# EAGLE board MusselGapeTracker_RevA_2 (EAGLE 7.6.0), part 1 of 2
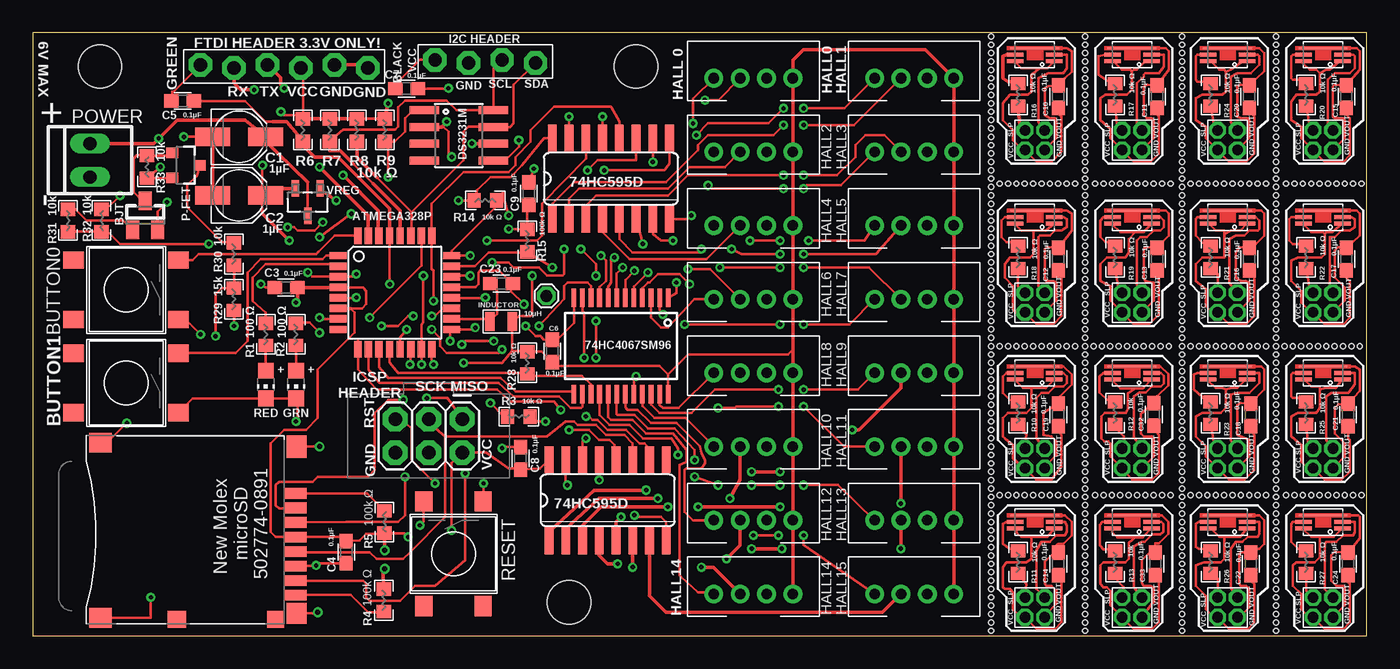
[diagram p1: board, top side]
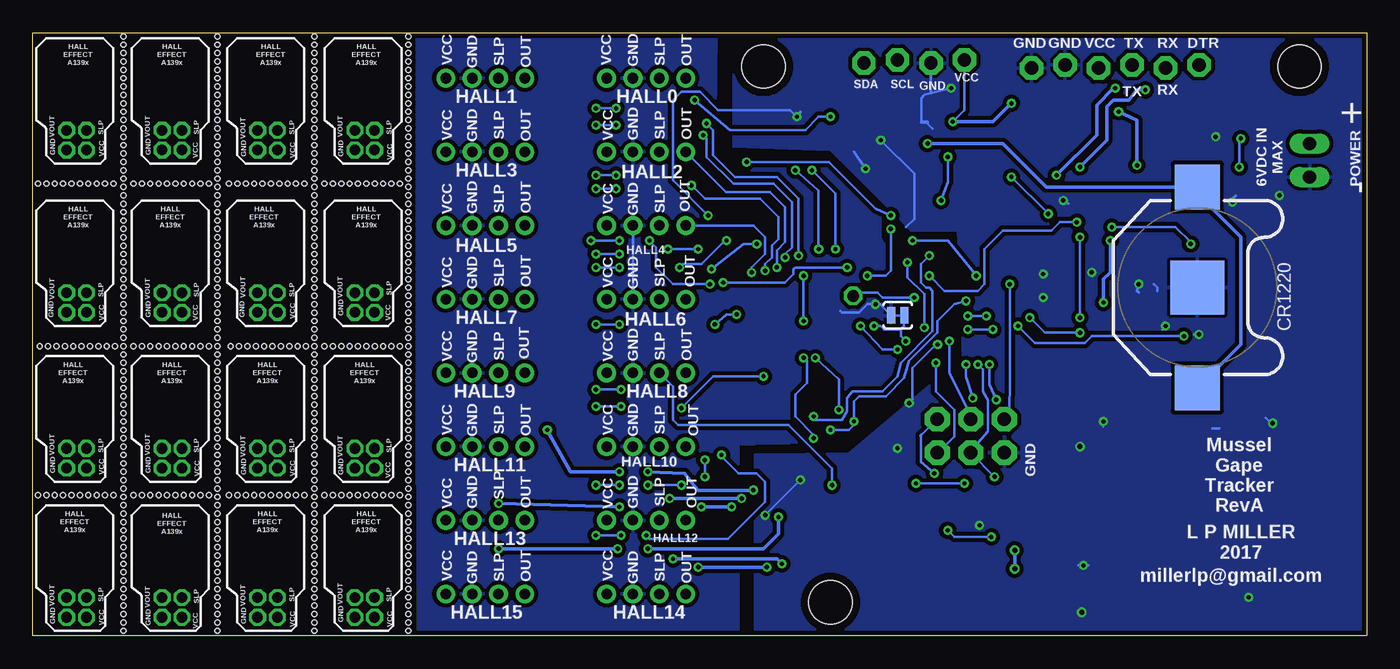
[diagram p2: board, bottom side, seen from below]

Size 101.09 x 45.72 mm. Coordinates in mm from the lower left corner, seen from the top.
Outline: 0,0 101.09,0 101.09,45.72 0,45.72 0,0
Copper layers (1*16): Top 0.0356mm / dielectric 1.5011mm / Bottom 0.0356mm
Design rules "LaenPCBOrder *": minimum track width 6mil, minimum drill 13mil, track to track 6mil, track to pad 6mil, pad to pad 6mil, via to via 6mil, smd to smd 6mil, copper to edge 15mil, drill to drill 6mil, minimum pad ring 7mil, minimum via ring 7mil, stop-mask expansion 3mil, vias tented up to drill 30mil, thermal gap 10mil
Holes 0.38 mm at 72.64,0.38 72.64,1.02 72.64,1.65 72.64,2.29 72.64,2.92 72.64,3.56 72.64,4.19 72.64,4.83 72.64,5.46 72.64,6.1 72.64,6.73 72.64,7.37 72.64,8 72.64,8.64 72.64,9.27 72.64,9.91 72.64,10.54 72.64,11.18 72.64,11.81 72.64,12.45 72.64,13.08 72.64,13.72 72.64,14.35 72.64,14.99 72.64,15.62 72.64,16.26 72.64,16.89 72.64,17.53 72.64,18.16 72.64,18.8 72.64,19.43 72.64,20.07 72.64,20.7 72.64,21.34 72.64,21.97 72.64,22.61 72.64,23.24 72.64,23.88 72.64,24.51 72.64,25.15 72.64,25.78 72.64,26.42 72.64,27.05 72.64,27.69 72.64,28.32 72.64,28.96 72.64,29.59 72.64,30.23 72.64,30.86 72.64,31.5 72.64,32.13 72.64,32.77 72.64,33.4 72.64,34.04 72.64,34.67 72.64,35.31 72.64,35.94 72.64,36.58 72.64,37.21 72.64,37.85 72.64,38.48 72.64,39.12 72.64,39.75 72.64,40.39 72.64,41.02 72.64,41.66 72.64,42.29 72.64,42.93 72.64,43.56 72.64,44.2 72.64,44.83 72.64,45.47 78.99,34.29 78.36,34.29 77.72,34.29 77.09,34.29 76.45,34.29 75.82,34.29 75.18,34.29 74.55,34.29 73.91,34.29 73.28,34.29 73.28,10.67 73.91,10.67 74.55,10.67 75.18,10.67 75.82,10.67 76.45,10.67 77.09,10.67 77.72,10.67 73.28,21.97 73.91,21.97 74.55,21.97 75.18,21.97 75.82,21.97 76.45,21.97 77.09,21.97 77.72,21.97 78.36,21.97 78.99,21.97 78.36,10.67 78.99,10.67 79.76,0.38 79.76,1.02 79.76,1.65 79.76,2.29 79.76,2.92 79.76,3.56 79.76,4.19 79.76,4.83 79.76,5.46 79.76,6.1 79.76,6.73 79.76,7.37 79.76,8 79.76,8.64 79.76,9.27 79.76,9.91 79.76,10.54 79.76,11.18 79.76,11.81 79.76,12.45 79.76,13.08 79.76,13.72 79.76,14.35 79.76,14.99 79.76,15.62 79.76,16.26 79.76,16.89 79.76,17.53 79.76,18.16 79.76,18.8 79.76,19.43 79.76,20.07 79.76,20.7 79.76,21.34 79.76,21.97 79.76,22.61 79.76,23.24 79.76,23.88 79.76,24.51 79.76,25.15 79.76,25.78 79.76,26.42 79.76,27.05 79.76,27.69 79.76,28.32 79.76,28.96 79.76,29.59 79.76,30.23 79.76,30.86 79.76,31.5 79.76,32.13 79.76,32.77 79.76,33.4 79.76,34.04 79.76,34.67 79.76,35.31 79.76,35.94 79.76,36.58 79.76,37.21 79.76,37.85 79.76,38.48 79.76,39.12 79.76,39.75 79.76,40.39 79.76,41.02 79.76,41.66 79.76,42.29 79.76,42.93 79.76,43.56 79.76,44.2 79.76,44.83 79.76,45.47 80.52,10.67 81.15,10.67 81.79,10.67 82.42,10.67 83.06,10.67 83.69,10.67 84.33,10.67 84.96,10.67 85.6,10.67 86.23,10.67 80.39,21.97 81.03,21.97 81.66,21.97 82.3,21.97 82.93,21.97 83.57,21.97 84.2,21.97 84.84,21.97 85.47,21.97 86.11,21.97 86.23,34.29 85.6,34.29 84.96,34.29 84.33,34.29 83.69,34.29 83.06,34.29 82.42,34.29 81.79,34.29 81.15,34.29 80.52,34.29 87.12,0.38 87.12,1.02 87.12,1.65 87.12,2.29 87.12,2.92 87.12,3.56 87.12,4.19 87.12,4.83 87.12,5.46 87.12,6.1 87.12,6.73 87.12,7.37 87.12,8 87.12,8.64 87.12,9.27 87.12,9.91 87.12,10.54 87.12,11.18 87.12,11.81 87.12,12.45 87.12,13.08 87.12,13.72 87.12,14.35 87.12,14.99 87.12,15.62 87.12,16.26 87.12,16.89 87.12,17.53 87.12,18.16 87.12,18.8 87.12,19.43 87.12,20.07 87.12,20.7 87.12,21.34 87.12,21.97 87.12,22.61 87.12,23.24 87.12,23.88 87.12,24.51 87.12,25.15 87.12,25.78 87.12,26.42 87.12,27.05 87.12,27.69 87.12,28.32 87.12,28.96 87.12,29.59 87.12,30.23 87.12,30.86 87.12,31.5 87.12,32.13 87.12,32.77 87.12,33.4 87.12,34.04 87.12,34.67 87.12,35.31 87.12,35.94 87.12,36.58 87.12,37.21 87.12,37.85 87.12,38.48 87.12,39.12 87.12,39.75 87.12,40.39 87.12,41.02 87.12,41.66 87.12,42.29 87.12,42.93 87.12,43.56 87.12,44.2 87.12,44.83 87.12,45.47 93.47,34.29 92.84,34.29 92.2,34.29 91.57,34.29 90.93,34.29 90.3,34.29 89.66,34.29 89.03,34.29 88.39,34.29 87.76,34.29 87.76,10.67 88.39,10.67 89.03,10.67 89.66,10.67 90.3,10.67 90.93,10.67 91.57,10.67 92.2,10.67 87.76,21.97 88.39,21.97 89.03,21.97 89.66,21.97 90.3,21.97 90.93,21.97 91.57,21.97 92.2,21.97 92.84,21.97 93.47,21.97 92.84,10.67 93.47,10.67 94.23,0.38 94.23,1.02 94.23,1.65 94.23,2.29 94.23,2.92 94.23,3.56 94.23,4.19 94.23,4.83 94.23,5.46 94.23,6.1 94.23,6.73 94.23,7.37 94.23,8 94.23,8.64 94.23,9.27 94.23,9.91 94.23,10.54 94.23,11.18 94.23,11.81 94.23,12.45 94.23,13.08 94.23,13.72 94.23,14.35 94.23,14.99 94.23,15.62 94.23,16.26 94.23,16.89 94.23,17.53 94.23,18.16 94.23,18.8 94.23,19.43 94.23,20.07 94.23,20.7 94.23,21.34 94.23,21.97 94.23,22.61 94.23,23.24 94.23,23.88 94.23,24.51 94.23,25.15 94.23,25.78 94.23,26.42 94.23,27.05 94.23,27.69 94.23,28.32 94.23,28.96 94.23,29.59 94.23,30.23 94.23,30.86 94.23,31.5 94.23,32.13 94.23,32.77 94.23,33.4 94.23,34.04 94.23,34.67 94.23,35.31 94.23,35.94 94.23,36.58 94.23,37.21 94.23,37.85 94.23,38.48 94.23,39.12 94.23,39.75 94.23,40.39 94.23,41.02 94.23,41.66 94.23,42.29 94.23,42.93 94.23,43.56 94.23,44.2 94.23,44.83 94.23,45.47 95,10.67 95.63,10.67 96.27,10.67 96.9,10.67 97.54,10.67 98.17,10.67 98.81,10.67 99.44,10.67 100.08,10.67 100.71,10.67 94.87,21.97 95.5,21.97 96.14,21.97 96.77,21.97 97.41,21.97 98.04,21.97 98.68,21.97 99.31,21.97 99.95,21.97 100.58,21.97 100.71,34.29 100.08,34.29 99.44,34.29 98.81,34.29 98.17,34.29 97.54,34.29 96.9,34.29 96.27,34.29 95.63,34.29 95,34.29
tRestrict: area 51.6,40.4 to 53.3,42.2; area 51.6,28.4 to 53.3,30.2

## Footprints (pad centres in the part's own frame; a part is rotated, then mirrored left to right if it is on the bottom)
A139*_HALL_EFFECT = smd 0.3 x 1.25: P$1 -0.5,-1.475; P$2 0,-1.475; P$5 0,1.475; P$6 -0.5,1.475 | smd 0.15 x 3.7: P$3_4 0.5,0
SOT23 = smd 1 x 1.4: 1 -0.95,-1.1; 2 0.95,-1.1; 3 0,1.1
PUSHBUTTON_DPST_SMD = smd 1.55 x 1.3: P 3.975,-2.25; P$1 -3.975,-2.25; S 3.975,2.25; S$1 -3.975,2.25
PANASONIC_B = smd 2.667 x 1.4: + 2.006,0; - -2.006,0
0603 = smd 1.1 x 1: 1 -0.85,0; 2 0.85,0
CR1220_BATTERY_HOLDER_SMD = smd 4.064 x 4.064: GND 0,0 | smd 3.429 x 3.429: P$1 -7.62,0; P$2 7.62,0
DS3231M_SOIC8 = smd 0.61 x 2.21: 1 -1.905,-2.616; 2 -0.635,-2.616; 3 0.635,-2.616; 4 1.905,-2.616; 5 1.905,2.616; 6 0.635,2.616; 7 -0.635,2.616; 8 -1.905,2.616
SJ_2S-TRACE = smd 0.635 x 1.27: 1 -0.508,0; 2 0.508,0
JST-PH-4-THM = drill 0.8 pad 1.422: 1 3,0; 2 1,0; 3 -1,0; 4 -3,0
2X2_1.5MM = drill 0.8 pad 1.27 octagon: P$1 -0.75,0.75; P$2 0.75,0.75; P$3 -0.75,-0.75; P$4 0.75,-0.75
1X04_BIGLOCK = drill 1.016 pad 1.778 octagon: 1 -3.81,0.127; 2 -1.27,-0.127; 3 1.27,0.127; 4 3.81,-0.127
I_0805 = smd 0.7 x 1.45: P$1 -0.85,0; P$2 0.85,0
2X3 = drill 1.016 pad 1.88 octagon: 1 -2.54,0; 2 -2.54,2.54; 3 0,0; 4 0,2.54; 5 2.54,0; 6 2.54,2.54
1X06-BIGLOCK = drill 1.016 pad 1.778 octagon: 1 -6.35,0.127; 2 -3.81,-0.127; 3 -1.27,0.127; 4 1.27,-0.127; 5 3.81,0.127; 6 6.35,-0.127
CHIPLED_0805 = smd 1.2 x 1.2: A 0,-1.05; C 0,1.05
SOT95P237X112-3N = smd 0.559 x 1.27: 1 -0.94,-1.041; 2 0.94,-1.041; 3 0,1.041
SOT23-3 = smd 0.8 x 0.9: 1 -0.95,-1; 2 0.95,-1; 3 0,1.1
R0603 = smd 1 x 1.1: 1 -0.85,0; 2 0.85,0
SO16 = smd 0.66 x 2.032: 1 -4.445,-3.073; 2 -3.175,-3.073; 3 -1.905,-3.073; 4 -0.635,-3.073; 5 0.635,-3.073; 6 1.905,-3.073; 7 3.175,-3.073; 8 4.445,-3.073; 9 4.445,3.073; 10 3.175,3.073; 11 1.905,3.073; 12 0.635,3.073; 13 -0.635,3.073; 14 -1.905,3.073; 15 -3.175,3.073; 16 -4.445,3.073
STAND-OFF = hole 3.302: 0,0
TQFP32-08 = smd 1.27 x 0.559: 1 -4.293,2.8; 2 -4.293,2; 3 -4.293,1.2; 4 -4.293,0.4; 5 -4.293,-0.4; 6 -4.293,-1.2; 7 -4.293,-2; 8 -4.293,-2.8; 17 4.293,-2.8; 18 4.293,-2; 19 4.293,-1.2; 20 4.293,-0.4; 21 4.293,0.4; 22 4.293,1.2; 23 4.293,2; 24 4.293,2.8 | smd 0.559 x 1.27: 9 -2.8,-4.293; 10 -2,-4.293; 11 -1.2,-4.293; 12 -0.4,-4.293; 13 0.4,-4.293; 14 1.2,-4.293; 15 2,-4.293; 16 2.8,-4.293; 25 2.8,4.293; 26 2,4.293; 27 1.2,4.293; 28 0.4,4.293; 29 -0.4,4.293; 30 -1.2,4.293; 31 -2,4.293; 32 -2.8,4.293
MICROSD_SOCKET_MOLEX_REVERSEMOUNT = smd 1.29 x 1.4: CARD_DETECT1 -0.645,8.12 | smd 1.29 x 1.3: CARD_DETECT2 -0.645,0.65 | smd 0.8 x 1.68: CS2 7.8,-0.84; GND6 3.4,-0.84; MISO7 2.3,-0.84; MOSI3 6.7,-0.84; NC1 8.9,-0.84; RES8 1.2,-0.84; SCK5 4.5,-0.84; VDD4 5.6,-0.84 | smd 1.6 x 1.5: MNT1 -0.2,-0.93 | smd 1.7 x 1.5: MNT2 12.45,-0.93 | smd 1.5 x 1.7: MNT3 -0.54,13.92; MNT4 12.75,13.92
SSOP24 = smd 0.348 x 1.397: 1 -3.575,-3.656; 2 -2.925,-3.656; 3 -2.275,-3.656; 4 -1.625,-3.656; 5 -0.975,-3.656; 6 -0.325,-3.656; 7 0.325,-3.656; 8 0.975,-3.656; 9 1.625,-3.656; 10 2.275,-3.656; 11 2.925,-3.656; 12 3.575,-3.656; 13 3.575,3.656; 14 2.925,3.656; 15 2.275,3.656; 16 1.625,3.656; 17 0.975,3.656; 18 0.325,3.656; 19 -0.325,3.656; 20 -0.975,3.656; 21 -1.625,3.656; 22 -2.275,3.656; 23 -2.925,3.656; 24 -3.575,3.656
1X01_SMALL = drill 0.9 pad 1.397 octagon: 1 0,0
22-23-2021 = drill 1 long: 1 -1.27,0; 2 1.27,0

## Placement (x,y rotation side)
A139_HALL0  HALL_EFFECT_ALLEGRO_A139MLP/DFN-6  [A139*_HALL_EFFECT]  75.95,44.07 90 top
A139_HALL1  HALL_EFFECT_ALLEGRO_A139MLP/DFN-6  [A139*_HALL_EFFECT]  75.95,8.64 90 top
A139_HALL2  HALL_EFFECT_ALLEGRO_A139MLP/DFN-6  [A139*_HALL_EFFECT]  75.95,19.94 90 top
A139_HALL3  HALL_EFFECT_ALLEGRO_A139MLP/DFN-6  [A139*_HALL_EFFECT]  83.31,19.94 90 top
A139_HALL4  HALL_EFFECT_ALLEGRO_A139MLP/DFN-6  [A139*_HALL_EFFECT]  83.31,8.64 90 top
A139_HALL5  HALL_EFFECT_ALLEGRO_A139MLP/DFN-6  [A139*_HALL_EFFECT]  83.31,44.07 90 top
A139_HALL6  HALL_EFFECT_ALLEGRO_A139MLP/DFN-6  [A139*_HALL_EFFECT]  75.95,31.75 90 top
A139_HALL7  HALL_EFFECT_ALLEGRO_A139MLP/DFN-6  [A139*_HALL_EFFECT]  83.31,31.75 90 top
A139_HALL8  HALL_EFFECT_ALLEGRO_A139MLP/DFN-6  [A139*_HALL_EFFECT]  90.55,44.07 90 top
A139_HALL9  HALL_EFFECT_ALLEGRO_A139MLP/DFN-6  [A139*_HALL_EFFECT]  97.79,44.07 90 top
A139_HALL10  HALL_EFFECT_ALLEGRO_A139MLP/DFN-6  [A139*_HALL_EFFECT]  90.55,31.75 90 top
A139_HALL11  HALL_EFFECT_ALLEGRO_A139MLP/DFN-6  [A139*_HALL_EFFECT]  97.79,31.75 90 top
A139_HALL12  HALL_EFFECT_ALLEGRO_A139MLP/DFN-6  [A139*_HALL_EFFECT]  90.55,19.94 90 top
A139_HALL13  HALL_EFFECT_ALLEGRO_A139MLP/DFN-6  [A139*_HALL_EFFECT]  97.79,19.94 90 top
A139_HALL14  HALL_EFFECT_ALLEGRO_A139MLP/DFN-6  [A139*_HALL_EFFECT]  90.55,8.64 90 top
A139_HALL15  HALL_EFFECT_ALLEGRO_A139MLP/DFN-6  [A139*_HALL_EFFECT]  97.79,8.64 90 top
BJT  KSC1623_BJT_TRANSISTOR  [SOT23]  8.51,31.88 0 top
BUTTON0  PUSHBUTTON_DPST_SMDSTANDARD  [PUSHBUTTON_DPST_SMD]  7.06,26.24 180 top
BUTTON1  PUSHBUTTON_DPST_SMDSTANDARD  [PUSHBUTTON_DPST_SMD]  7.06,19.18 180 top
C1  1µF  [PANASONIC_B]  15.62,37.85 0 top
C2  1µF  [PANASONIC_B]  15.62,33.4 0 top
C3  0.1µF  [0603]  19.18,26.42 180 top
C4  0.1µF  [0603]  23.75,6.35 270 top
C5  0.1µF  [0603]  11.35,40.56 0 top
C6  0.1µF  [0603]  39.37,21.59 90 top
C7  0.1µF  [0603]  28.32,41.5 0 top
C8  0.1µF  [0603]  36.96,13.46 90 top
C9  0.1µF  [0603]  37.59,33.53 90 top
C10  0.1µF  [0603]  77.72,40.89 90 top
C11  0.1µF  [0603]  85.22,40.89 90 top
C12  0.1µF  [0603]  77.72,28.57 90 top
C13  0.1µF  [0603]  85.22,28.57 90 top
C14  0.1µF  [0603]  77.72,5.46 90 top
C15  0.1µF  [0603]  99.57,40.89 90 top
C16  0.1µF  [0603]  92.2,28.57 90 top
C17  0.1µF  [0603]  99.57,28.57 90 top
C18  0.1µF  [0603]  92.33,16.76 90 top
C19  0.1µF  [0603]  77.72,16.76 90 top
C20  0.1µF  [0603]  92.2,40.89 90 top
C21  0.1µF  [0603]  99.69,16.76 90 top
C22  0.1µF  [0603]  92.33,5.46 90 top
C23  0.1µF  [0603]  35.51,26.72 0 top
C24  0.1µF  [0603]  99.69,5.46 90 top
C32  0.1µF  [0603]  84.96,16.79 90 top
C33  0.1µF  [0603]  85.09,5.46 90 top
CR1220_BATTERY  CR1220_BATTERY_HOLDERSMD  [CR1220_BATTERY_HOLDER_SMD]  12.83,26.42 270 bottom
DS3231M  DS3231MSOIC-8  [DS3231M_SOIC8]  32.28,37.95 270 top
GROUND_CON  SOLDER_JUMPER_TRACESTANDARD  [SJ_2S-TRACE]  35.53,24.31 180 bottom
HALL0  JST-4PINTH_STRAIGHT  [JST-PH-4-THM]  54.61,42.29 0 top
HALL0_HEADER  PINHD-2X21.5MM_SILK  [2X2_1.5MM]  75.95,37.59 180 top
HALL1  JST-4PINTH_STRAIGHT  [JST-PH-4-THM]  66.8,42.29 0 top
HALL1_HEADER  PINHD-2X21.5MM_SILK  [2X2_1.5MM]  75.95,2.16 180 top
HALL2  JST-4PINTH_STRAIGHT  [JST-PH-4-THM]  54.61,36.7 0 top
HALL2_HEADER  PINHD-2X21.5MM_SILK  [2X2_1.5MM]  75.95,13.46 180 top
HALL3  JST-4PINTH_STRAIGHT  [JST-PH-4-THM]  66.8,36.7 0 top
HALL3_HEADER  PINHD-2X21.5MM_SILK  [2X2_1.5MM]  83.31,13.46 180 top
HALL4  JST-4PINTH_STRAIGHT  [JST-PH-4-THM]  54.61,31.11 0 top
HALL4_HEADER  PINHD-2X21.5MM_SILK  [2X2_1.5MM]  83.31,2.16 180 top
HALL5  JST-4PINTH_STRAIGHT  [JST-PH-4-THM]  66.8,31.11 0 top
HALL5_HEADER  PINHD-2X21.5MM_SILK  [2X2_1.5MM]  83.31,37.59 180 top
HALL6  JST-4PINTH_STRAIGHT  [JST-PH-4-THM]  54.61,25.53 0 top
HALL6_HEADER  PINHD-2X21.5MM_SILK  [2X2_1.5MM]  75.95,25.27 180 top
HALL7  JST-4PINTH_STRAIGHT  [JST-PH-4-THM]  66.8,25.53 0 top
HALL7_HEADER  PINHD-2X21.5MM_SILK  [2X2_1.5MM]  83.31,25.27 180 top
HALL8  JST-4PINTH_STRAIGHT  [JST-PH-4-THM]  54.61,19.94 0 top
HALL8_HEADER  PINHD-2X21.5MM_SILK  [2X2_1.5MM]  90.55,37.59 180 top
HALL9  JST-4PINTH_STRAIGHT  [JST-PH-4-THM]  66.8,19.94 0 top
HALL9_HEADER  PINHD-2X21.5MM_SILK  [2X2_1.5MM]  97.79,37.59 180 top
HALL10  JST-4PINTH_STRAIGHT  [JST-PH-4-THM]  54.61,14.35 0 top
HALL10_HEADER  PINHD-2X21.5MM_SILK  [2X2_1.5MM]  90.55,25.27 180 top
HALL11  JST-4PINTH_STRAIGHT  [JST-PH-4-THM]  66.8,14.35 0 top
HALL11_HEADER  PINHD-2X21.5MM_SILK  [2X2_1.5MM]  97.79,25.27 180 top
HALL12  JST-4PINTH_STRAIGHT  [JST-PH-4-THM]  54.61,8.76 0 top
HALL12_HEADER  PINHD-2X21.5MM_SILK  [2X2_1.5MM]  90.55,13.46 180 top
HALL13  JST-4PINTH_STRAIGHT  [JST-PH-4-THM]  66.8,8.76 0 top
HALL13_HEADER  PINHD-2X21.5MM_SILK  [2X2_1.5MM]  97.79,13.46 180 top
HALL14  JST-4PINTH_STRAIGHT  [JST-PH-4-THM]  54.61,3.17 0 top
HALL14_HEADER  PINHD-2X21.5MM_SILK  [2X2_1.5MM]  90.55,2.16 180 top
HALL15  JST-4PINTH_STRAIGHT  [JST-PH-4-THM]  66.8,3.17 0 top
HALL15_HEADER  PINHD-2X21.5MM_SILK  [2X2_1.5MM]  97.79,2.16 180 top
I2C_HEADER  PINHD-1X4BIG_LOCK  [1X04_BIGLOCK]  34.29,43.56 0 top
INDUCTOR  10µH  [I_0805]  35.48,23.85 0 top
J1  AVR_SPI_PRG_6PTH  [2X3]  30,16.43 180 top
JP1  FTDI_HEADER  [1X06-BIGLOCK]  19.05,43.18 180 top
LED1  RED_LED  [CHIPLED_0805]  17.65,19.05 180 top
LED2  GREEN_LED  [CHIPLED_0805]  19.94,19.05 180 top
MCP1700T-3302  MCP1700T-3302E/TT  [SOT95P237X112-3N]  20.83,32.89 180 top
P-FET  MOSFET-PCHANNELBSH203  [SOT23-3]  11.56,35.69 270 top
R1  100 Ω  [R0603]  17.65,22.86 90 top
R2  100 Ω  [R0603]  19.94,22.86 90 top
R3  10k Ω  [R0603]  36.83,16.64 0 top
R4  100k Ω  [R0603]  26.59,2.69 90 top
R5  100k Ω  [R0603]  26.64,8.64 270 top
R6  10k Ω  [R0603]  20.47,38.35 90 top
R7  10k Ω  [R0603]  22.5,38.35 90 top
R8  10k Ω  [R0603]  24.56,38.35 90 top
R9  10k Ω  [R0603]  26.67,38.35 90 top
R10  10k Ω  [R0603]  74.68,16.89 90 top
R11  10k Ω  [R0603]  74.68,5.59 90 top
R12  10k Ω  [R0603]  82.04,16.89 90 top
R13  10k Ω  [R0603]  82.04,5.59 90 top
R14  10k Ω  [R0603]  34.29,33.02 180 top
R15  100k Ω  [R0603]  37.47,29.97 90 top
R16  10k Ω  [R0603]  74.68,41.02 90 top
R17  10k Ω  [R0603]  82.04,41.02 90 top
R18  10k Ω  [R0603]  74.68,28.7 90 top
R19  10k Ω  [R0603]  82.04,28.7 90 top
R20  10k Ω  [R0603]  96.52,41.02 90 top
R21  10k Ω  [R0603]  89.28,28.7 90 top
R22  10k Ω  [R0603]  96.52,28.7 90 top
R23  10k Ω  [R0603]  89.28,16.89 90 top
R24  10k Ω  [R0603]  89.28,41.02 90 top
R25  10k Ω  [R0603]  96.52,16.89 90 top
R26  10k Ω  [R0603]  89.28,5.59 90 top
R27  10k Ω  [R0603]  96.52,5.59 90 top
R28  10k Ω  [R0603]  37.47,20.7 90 top
R29  15k  [R0603]  15.24,25.53 90 top
R30  10k  [R0603]  15.24,28.96 90 top
R31  10k  [R0603]  2.67,31.5 90 top
R32  10k  [R0603]  5.21,31.5 270 top
R33  10k  [R0603]  8.64,35.56 270 top
RESET  PUSHBUTTON_DPST_SMDSTANDARD  [PUSHBUTTON_DPST_SMD]  31.88,6.22 270 top
SHIFT_0  74HC595D  [SO16]  43.81,34.67 0 top
SHIFT_1  74HC595D  [SO16]  43.56,10.29 0 top
STANDOFF1  STAND-OFF  [STAND-OFF]  45.72,43.18 0 top
STANDOFF2  STAND-OFF  [STAND-OFF]  5.08,43.18 0 top
STANDOFF3  STAND-OFF  [STAND-OFF]  40.64,2.54 0 top
U1  ATMEGA328P  [TQFP32-08]  27.43,26.04 0 top
U$1  MICROSD_MOLEX_REVERSECURRENT  [MICROSD_SOCKET_MOLEX_REVERSEMOUNT]  19.05,1.91 90 top
U$2  74HC4067SM96  [SSOP24]  44.58,21.97 180 top
U$17  PINHD-1X1SMALL  [1X01_SMALL]  38.91,25.78 0 top
X1  22-23-2021  [22-23-2021]  4.32,36.07 90 top

## Tracks (layer width: path | path; a pad name or v marks a point on that pad's centre or on a via)
32KHZ  (via drill 0.33)
  Top 0.178: 28.8,39.85 28.19,39.24 28.19,38.23 | U1.7 21.81,24.04 v21.72,24.13 | v21.72,30.23 v24.13,32 | v26.92,34.8 26.92,37.1 R9.1
  Top 0.203: DS3231M.1 28.8,39.85 | 27.07,37.34 R9.1 26.78,37.47 27.43,37.47 28.19,38.23
  Top 0.254: DS3231M.1 29.69,39.85
  Bottom 0.178: v21.72,24.13 v21.72,30.23 | v24.13,32 v26.92,34.8
!SLEEP0
  Top 0.254: A139_HALL0.P$5 73.79,44.07 73.53,43.94 73.53,42.29 73.91,42.04 74.79,42.04 R16.2
!SLEEP1
  Top 0.178: A139_HALL1.P$5 73.79,8.64 73.53,8.51 73.53,6.99 74.04,6.6 74.66,6.6 R11.2
!SLEEP2
  Top 0.178: A139_HALL2.P$5 73.79,19.94 73.53,19.68 73.53,18.41 74.04,17.91 74.66,17.91 R10.2
!SLEEP3
  Top 0.178: A139_HALL3.P$5 81.13,19.94 80.85,19.66 80.85,18.47 81.43,17.88 82.03,17.88 R12.2
!SLEEP4
  Top 0.178: A139_HALL4.P$5 81.08,8.64 80.87,8.43 80.87,6.86 81.15,6.58 82.03,6.58 R13.2
!SLEEP5
  Top 0.178: R17.2 81.55,42.02 80.77,42.55 80.77,43.94 81.28,44.07 A139_HALL5.P$5
!SLEEP6
  Top 0.178: A139_HALL6.P$5 73.66,31.75 73.41,31.5 73.41,30.23 73.79,29.84 74.66,29.84 R18.2
!SLEEP7
  Top 0.178: A139_HALL7.P$5 81.15,31.75 80.9,31.5 80.9,30.23 81.28,29.84 82.28,29.84 R19.2
!SLEEP8
  Top 0.178: A139_HALL8.P$5 88.27,44.07 88.14,43.94 88.14,42.16 88.27,42.04 89.52,42.04 R24.2
!SLEEP9
  Top 0.178: A139_HALL9.P$5 95.5,44.07 95.38,43.94 95.38,42.29 95.5,42.16 96.76,42.16 R20.2
!SLEEP10
  Top 0.178: R21.2 88.66,29.83 88.14,30.35 88.14,31.62 88.27,31.75 A139_HALL10.P$5
!SLEEP11
  Top 0.178: A139_HALL11.P$5 95.38,31.75 95.25,31.62 95.25,29.97 95.5,29.72 96.76,29.72 R22.2
!SLEEP12
  Top 0.178: R23.2 88.92,17.89 88.01,18.67 88.01,19.81 88.27,19.94 A139_HALL12.P$5
!SLEEP13
  Top 0.178: A139_HALL13.P$5 95.5,19.94 95.38,19.81 95.38,18.16 95.5,18.03 96.63,18.03 R25.2
!SLEEP14
  Top 0.178: A139_HALL14.P$5 88.39,8.64 88.14,8.51 88.14,6.73 88.39,6.6 89.52,6.6 R26.2
!SLEEP15
  Top 0.178: R27.2 95.9,6.59 95.38,7.11 95.38,8.51 95.5,8.64 A139_HALL15.P$5
AGND  (via drill 0.33)
  Top 0.178: U1.21 33.55,26.43 33.78,26.67 33.78,27.56 33.91,27.69 35.32,27.69 C23.2 36.23,26.12 v37.21,25.15
  Bottom 0.178: GROUND_CON.2 36.88,25.15 v37.21,25.15 37.85,25.15 38.48,24.51 39.75,24.51 39.88,24.64 | HALL4.2 HALL6.2
  pour Bottom (isolate 0.305): 71.88,0 47.62,0 47.62,14.5 39.75,14.73 34.9,18.31 33.32,19.58 32.82,20.02 32.03,21.29 32.41,29.72 36.58,29.72 36.83,30.18 36.83,31.75 40.64,35.56 49.23,35.89 49.4,36.07 49.28,45.72 72.14,45.72
ANALOG_0  (via drill 0.33)
  Top 0.178: U$2.1 48.79,26.02 48.77,26.04 v48.77,26.8 | R15.1 39.35,27.96 v39.37,27.94 | 37.35,29.08 R15.1 | U1.23 33.5,28.04 34.54,29.08 37.43,29.08 R15.1
  Bottom 0.178: v39.37,27.94 43.31,27.94 43.43,27.81 43.43,27.43 44.07,26.8 v48.77,26.8
AVCC
  Top 0.178: U1.18 34.45,24.04 INDUCTOR.P$1 | INDUCTOR.P$1 34.63,23.97 | 34.48,24 INDUCTOR.P$1 | C23.1 34.62,26.72 35.18,26.16 35.18,24.4 INDUCTOR.P$1
BATT_MONITOR  (via drill 0.33)
  Top 0.178: R30.1 R29.2 14.31,26.38 13.84,25.91 v13.84,22.73 | v26.42,23.5 27.69,23.5 28.45,24.26 v28.83,24.26 | v30.23,24.26 30.48,24.26 31.11,24.89 31.67,24.89 U1.19
  Bottom 0.178: v13.84,22.73 20.83,22.73 21.34,22.23 25.15,22.23 v26.42,23.5 | v28.83,24.26 v30.23,24.26
BATT_MONITOR_EN  (via drill 0.33)
  Top 0.178: R31.1 R32.2 5.68,30.65 6.6,29.72 v13.34,29.72 | v33.15,27.3 31.8,27.3 U1.22 | v21.97,31.37 21.34,30.73 20.07,30.73 19.81,30.99 v19.3,30.99
  Bottom 0.178: v33.15,27.3 32,26.16 29.46,26.16 28.96,26.67 28.96,29.34 27.56,30.73 23.88,30.73 23.24,31.37 v21.97,31.37 | v13.34,29.72 13.34,29.84 14.48,30.99 v19.3,30.99
BUTTON0
  Top 0.178: U1.32 24.61,30.35 22.86,30.35 21.65,29.15 21.59,29.08 21.46,28.96 12.57,28.96 12.11,28.49 BUTTON0.P$1
BUTTON1
  Top 0.178: U1.1 22.23,28.83 21.97,28.57 17.27,28.57 16.26,27.56 16.26,22.35 15.37,21.46 11.12,21.46 BUTTON1.P$1
  Top 0.254: U1.1
CS_SD  (via drill 0.33)
  Top 0.178: U1.14 28.63,20.76 v28.57,20.57 | v28.07,17.91 26.92,17.91 25.91,16.89 25.91,12.57 25.4,12.06 21.59,12.06 21.21,11.68 18.67,11.68 18.41,11.43 18.41,9.91 18.67,9.65 19.84,9.65 U$1.CS2
  Bottom 0.178: v28.57,20.57 28.57,19.05 v28.07,17.91
CS_SHIFT_REG  (via drill 0.33)
  Top 0.178: SHIFT_0.12 44.45,38.99 43.81,40.13 39.5,40.13 37.72,38.35 37.72,37.47 36.58,36.32 36.58,35.69 36.07,35.18 32.64,35.18 30.23,32.77 U1.25 30.23,27.81 30.35,27.69 v30.35,25.4 | v38.86,16.26 38.21,16.26 R3.2 | SHIFT_1.12 44.07,13.49 44.07,14.48 43.69,14.86 42.93,14.86 42.16,15.62 v40.64,15.62
  Bottom 0.178: v30.35,25.4 31.24,25.15 32.51,23.88 32.51,22.99 34.67,20.83 35.05,19.56 36.45,18.16 38.48,18.16 38.86,17.78 v38.86,16.26 38.86,16 39.24,15.62 v40.64,15.62
DTR
  Top 0.178: C5.1 10.54,40.6 10.54,41.27 10.67,41.27 JP1.6
GATE
  Top 0.178: BJT.3 8.3,32.98 7.62,33.66 7.62,36.2 7.87,36.45 8.6,36.45 R33.1 10.2,36.41 P-FET.1
GND  (via drill 0.33, 0.38 pad 0.61)
  Top 0.178: v8.94,2.92 8.94,1.37 U$1.MNT3 | C9.2 v37.97,35.43 | SHIFT_0.13 v43.18,39.37 | SHIFT_0.8 49.63,31.6 v49.91,31.88 | U$2.12 41,23.73 39.76,22.49 C6.2 38.72,22.49 38.48,22.73 38.1,22.73 v37.34,23.5 | RESET.P$1 29.63,8.67 v29.34,8.38 | R3.1 35.69,16.64 v34.67,17.65 | v34.92,22.35 32.77,22.35 v32.51,22.1 | SHIFT_1.8 48.01,8.64 47.62,9.02 45.72,9.02 v45.59,9.14 | v42.93,11.81 SHIFT_1.13 | C3.2 17.65,26.42 v17.27,26.67 | U1.5 24.49,25.64 v24.51,25.65 | v24.51,27.43 24.31,27.23 U1.3 21.15,27.23 v20.83,27.56 | MCP1700T-3302.1 21.69,33.93 | LED2.C LED1.C 12.11,18 BUTTON1.S$1 | LED2.C 19.94,17.52 | v19.94,16.26 20.07,16.38 20.07,17.87 LED2.C | DS3231M.5 35.79,36.04 36.83,37.08 v36.83,37.59 | BUTTON0.S$1 11.57,23.99 v12.7,22.86 | R29.1 v15.24,23.5 | R32.1 5.55,32.35 v6.6,33.4 | BJT.2 9.46,32.19 v10.16,32.89 | C1.- v11.43,37.85 | U$1.GND6 21.43,5.3 v21.46,5.33 | U$1.MNT1 21.52,1.71 v21.59,1.78 | U$1.MNT4 5.64,14.65 v7.11,16.13 | 21.58,5.45 v21.46,5.33 | v31.5,41.53 31.52,41.5 C7.2 | C4.2 21.63,5.5 v21.46,5.33 | C8.2 35.65,14.31 v35.56,14.22
  Top 0.203: U$1.MNT2 v21.71,14.36 v21.72,14.35
  Top 0.254: JP1.2 25.15,43.31 JP1.1 | 21.69,33.93 v22.99,33.02 | C1.- C2.-
  Bottom 0.178: v37.97,35.43 38.86,36.7 | 42.93,39.75 43.05,39.37 v43.18,39.37 43.69,39.88 49.15,39.88 50.55,41.27 51.94,41.27 52.58,40.64 52.58,34.54 v49.91,31.88 | v37.34,23.5 36.83,23.5 36.58,23.24 35.31,23.24 | 35.31,23.24 35.05,23.5 35.05,24.28 GROUND_CON.1 | v29.34,8.38 29.21,8.26 | v35.56,14.22 35.31,14.22 | 34.42,17.65 v34.67,17.65 34.42,17.91 34.42,20.32 32.64,22.1 v32.51,22.1 | 35.31,23.24 35.31,22.73 v34.92,22.35 | v45.59,9.14 v42.93,11.81 | 15.88,26.16 15.88,26.42 16.13,26.67 | v17.27,26.67 17.4,26.16 17.27,26.04 | v24.51,25.65 24.77,25.65 | v24.51,27.43 24.51,27.56 24.64,27.69 | v22.99,33.02 22.61,32.77 | v19.94,16.26 19.94,15.88 | 11.18,15.75 11.68,15.75 | 37.08,37.72 36.96,37.59 v36.83,37.59 34.29,35.05 34.29,31.62 34.92,30.99 | v12.7,22.86 13.08,22.86 | v15.24,23.5 15.49,23.24 | v20.83,27.56 20.83,27.43 20.95,27.3 | v6.6,33.4 6.6,33.53 6.48,33.66 | v10.16,32.89 10.16,33.15 9.91,33.4 | v11.43,37.85 11.3,37.85 | 21.84,5.33 v21.46,5.33 21.08,5.33 | v7.11,16.13 7.24,16.13 7.62,16.51 | 33.76,38.96 33.76,40.79 33.53,41.02 v31.5,41.53 33.02,41.15 I2C_HEADER.2
  Bottom 0.203: 22.99,43.18 JP1.2 | 32.92,38.48 33.4,38.96
  Bottom 0.254: 33.76,38.96 33.4,38.96 33.28,38.96
  pour Bottom (isolate 0.305): 0,45.72 48.01,45.72 48.01,37.08 40.64,36.83 34.54,30.73 30.99,30.73 30.61,21.11 39.24,13.84 45.75,13.74 46.35,13.74 46.35,0 0,0
HALL0_!SLEEP  (via drill 0.33)
  Top 0.178: SHIFT_0.15 v40.64,39.37 | v50.93,40.64 51.96,40.64 HALL0.3
  Bottom 0.178: v40.64,39.37 41.53,39.37 42.55,38.35 48.26,38.35 v50.93,40.64
HALL0_!SLEEP_IN
  Top 0.254: R16.1 74.8,38.73 HALL0_HEADER.P$4
HALL0_GND
  Top 0.178: A139_HALL0.P$3_4 78.37,44.57 78.74,44.32 78.74,42.8 78.23,42.29 78.22,42.29 C10.2 76.97,41.67 76.71,41.53 76.71,39.5 77.09,39.24 77.47,39.24 77.6,39.12 77.6,37.74 HALL0_HEADER.P$1
HALL0_OUTPUT  (via drill 0.33)
  Top 0.178: U$2.9 42.95,26.44 43.43,26.92 43.43,28.45 v43.05,28.83 | v50.04,38.86 50.04,40.72 HALL0.4
  Bottom 0.178: v43.05,28.83 43.05,33.15 44.7,34.8 47.88,34.8 49.53,36.45 49.53,38.35 v50.04,38.86
HALL0_VCC
  Top 0.178: A139_HALL0.P$6 74.47,43.51 74.93,43.05 76.33,43.05 | 76.33,43.05 76.91,43.05 A139_HALL0.P$1 | 76.33,43.05 75.69,42.55 75.69,41.27 75.44,41.02 74.04,41.02 73.53,40.39 73.53,39.12 74.3,38.35 74.3,37.59 75.05,36.84 HALL0_HEADER.P$2 76.1,35.94 77.22,35.94 77.98,36.7 77.98,39.37 77.72,39.62 C10.1
HALL0_VOUT
  Top 0.178: A139_HALL0.P$2 78.36,44.07 78.36,43.05 78.11,42.67 76.96,42.67 76.2,42.29 76.2,38.97 HALL0_HEADER.P$3
HALL1_!SLEEP  (via drill 0.33)
  Top 0.178: SHIFT_0.1 39.37,32.77 41.02,34.42 48.01,34.42 50.42,36.83 50.42,37.21 51.18,37.97 56.13,37.97 v56.9,38.73 | v58.42,38.73 62.25,38.73 HALL1.3
  Bottom 0.178: v56.9,38.73 v58.42,38.73
HALL1_!SLEEP_IN
  Top 0.178: HALL1_HEADER.P$4 75.31,3.95 R11.1
HALL1_GND
  Top 0.178: 77.71,6.6 C14.2 | HALL1_HEADER.P$1 76.71,1.52 77.6,2.41 77.6,3.43 77.22,3.81 76.83,3.81 76.71,3.94 76.71,5.6 77.47,6.36 C14.2 | A139_HALL1.P$3_4 78.24,9.14 78.74,8.64 78.74,7.62 78.11,6.99 77.72,6.99 77.6,6.86 C14.2
HALL1_OUTPUT  (via drill 0.33)
  Top 0.178: U$2.8 43.6,26.46 43.81,26.8 43.81,28.57 v44.07,28.7 | v50.29,37.97 51.18,38.86 55.75,38.86 v56.9,40.01 | v58.42,40.01 61.52,40.01 HALL1.4
  Bottom 0.178: v50.29,37.97 50.04,37.72 50.04,36.32 48.01,34.29 44.96,34.29 43.56,32.89 43.56,29.46 44.07,28.96 v44.07,28.7 | v56.9,40.01 v58.42,40.01
HALL1_VCC
  Top 0.178: A139_HALL1.P$6 74.6,7.83 74.93,7.49 75.69,7.49 | 75.69,7.49 76.91,7.49 A139_HALL1.P$1 | 75.69,7.49 75.69,5.84 75.31,5.59 73.79,5.59 73.53,5.21 73.53,3.68 73.66,3.56 74.04,3.56 74.3,3.3 74.3,2.03 74.8,1.52 HALL1_HEADER.P$2 76.1,0.51 77.47,0.51 77.98,1.02 77.98,4.06 77.6,4.45 C14.1 77.61,4.69
HALL1_VOUT
  Top 0.178: HALL1_HEADER.P$3 76.07,3.56 76.07,6.48 76.45,7.11 77.09,7.11 77.6,7.62 78.23,7.62 78.36,7.87 78.36,8.38 78.23,8.64 A139_HALL1.P$2
HALL2_!SLEEP
  Top 0.178: SHIFT_0.2 40.64,33.15 41.4,33.91 48.13,33.91 49.78,35.56 52.47,35.56 HALL2.3
HALL2_!SLEEP_IN
  Top 0.178: HALL2_HEADER.P$4 75.31,15.26 R10.1
HALL2_GND
  Top 0.178: HALL2_HEADER.P$1 76.71,12.83 77.6,13.72 77.6,14.73 77.22,15.11 76.58,15.24 76.58,16.9 C19.2 77.85,17.92 77.85,18.16 78.74,19.05 78.74,19.81 78.11,20.44 A139_HALL2.P$3_4
HALL2_OUTPUT  (via drill 0.33)
  Top 0.178: U$2.7 44.25,27.49 v44.7,27.94
  Bottom 0.178: HALL2.4 48.56,33.66 45.21,33.66 44.07,32.51 44.07,29.84 44.7,29.21 v44.7,27.94
HALL2_VCC
  Top 0.178: A139_HALL2.P$6 74.47,19.38 75.06,18.8 75.69,18.8 | 75.69,18.8 76.78,18.8 A139_HALL2.P$1 | 75.69,18.8 75.69,17.27 75.31,16.89 73.91,16.89 73.53,16.51 73.53,15.11 73.66,14.99 74.3,14.48 74.3,13.46 75.06,12.83 HALL2_HEADER.P$2 76.07,11.81 77.22,11.81 77.85,12.7 77.98,12.83 77.98,15.24 77.6,15.62 C19.1
HALL2_VOUT
  Top 0.178: A139_HALL2.P$2 78.11,19.94 78.36,19.68 78.36,19.18 78.11,18.92 77.47,18.92 76.96,18.41 76.45,18.41 76.07,18.03 76.07,14.99 HALL2_HEADER.P$3
HALL3_!SLEEP  (via drill 0.33)
  Top 0.178: SHIFT_0.3 41.91,32.64 42.67,33.4 48.13,33.4 49.66,34.92 v56.9,34.92 | HALL3.3 64.53,37.97 63.12,37.97 62.36,37.21 62.36,36.32 60.96,34.92 v58.42,34.92
  Bottom 0.178: v58.42,34.92 v56.9,34.92
HALL3_!SLEEP_IN
  Top 0.178: R12.1 82.04,15.77 82.68,15.14 82.68,14.33 HALL3_HEADER.P$4
HALL3_GND
  Top 0.178: A139_HALL3.P$3_4 85.45,20.44 86.08,19.86 86.08,18.97 85.24,18.19 85.24,17.97 C32.2 84.96,17.68 83.97,16.84 83.97,15.34 84.2,15.11 84.84,15.11 84.96,14.99 84.96,13.61 HALL3_HEADER.P$1
HALL3_OUTPUT  (via drill 0.33)
  Top 0.178: U$2.6 44.9,27 v45.59,27.69 | HALL3.4 61.26,34.16 58.67,34.16 v58.42,33.91 | v56.9,33.91 51.44,33.91 v51.18,34.16
  Bottom 0.178: v51.18,34.16 50.16,33.15 45.97,33.15 44.58,31.75 44.58,30.1 45.09,29.59 45.09,28.7 45.59,28.19 v45.59,27.69 | v58.42,33.91 v56.9,33.91
HALL3_VCC
  Top 0.178: A139_HALL3.P$6 81.84,19.36 82.42,18.77 83.52,18.77 | A139_HALL3.P$1 84.2,18.85 84.2,18.82 84.15,18.77 83.52,18.77 | 83.52,18.77 83.01,18.39 83.01,17.2 82.83,16.89 81.25,16.89 81,16.64 81,14.96 81.2,14.76 81.51,14.76 81.66,14.61 81.66,13.61 HALL3_HEADER.P$2 83.34,11.81 84.84,11.81 85.34,12.32 85.34,15.24 84.96,15.75 C32.1
HALL3_VOUT
  Top 0.178: A139_HALL3.P$2 85.5,19.94 85.72,19.71 85.72,19.15 85.5,18.92 84.84,18.92 84.35,18.44 83.87,18.44 83.44,18.14 83.44,15.09 HALL3_HEADER.P$3
HALL4_!SLEEP
  Top 0.178: HALL4.3 51.07,28.57 45.21,28.57 43.18,30.61 SHIFT_0.4
HALL4_!SLEEP_IN
  Top 0.178: R13.1 82.04,4.34 82.65,3.73 82.65,2.82 HALL4_HEADER.P$4
HALL4_GND
  Top 0.178: HALL4_HEADER.P$1 84.84,2.41 84.96,2.54 84.96,3.68 84.71,3.81 84.2,3.81 84.12,3.89 84.07,4.01 84.07,5.71 84.72,6.36 C33.2 85.09,7.01 85.34,7.01 86.06,7.72 86.06,8.66 85.58,9.14 A139_HALL4.P$3_4
HALL4_OUTPUT  (via drill 0.33)
  Top 0.178: U$2.5 45.55,26.5 v46.61,27.56
  Bottom 0.178: v46.61,27.56 46.61,27.94 45.59,28.96 45.59,30.23 46.48,31.11 HALL4.4
HALL4_VCC
  Top 0.178: A139_HALL4.P$6 81.84,7.85 82.22,7.47 84.12,7.47 A139_HALL4.P$1 84.77,8.14 84.12,7.49 83.62,7.49 83.06,7.06 83.06,5.84 82.8,5.59 81.15,5.59 80.9,5.33 80.9,3.94 81.15,3.68 81.41,3.68 81.66,3.43 81.66,2.31 HALL4_HEADER.P$2 83.46,0.51 84.84,0.51 85.34,1.02 85.34,4.06 84.96,4.45 C33.1
HALL4_VOUT
  Top 0.178: A139_HALL4.P$2 85.52,8.64 85.67,8.48 85.67,7.9 85.47,7.7 84.86,7.7 84.3,7.14 84.05,7.14 83.44,6.78 83.44,3.68 HALL4_HEADER.P$3
HALL5_!SLEEP  (via drill 0.33)
  Top 0.178: 50.55,29.08 v50.67,29.34 50.42,29.08 45.47,29.08 44.45,30.1 SHIFT_0.5 | v52.96,29.34 53.72,28.96 v56.64,28.96 | v58.42,28.96 63.9,28.96 HALL5.3
  Bottom 0.178: v50.67,29.34 v52.96,29.34 | v56.64,28.96 v58.42,28.96
HALL5_!SLEEP_IN
  Top 0.178: R17.1 82.17,38.73 HALL5_HEADER.P$4
HALL5_GND
  Top 0.178: HALL5_HEADER.P$1 84.96,37.74 84.96,39.12 84.84,39.24 84.45,39.24 84.2,39.5 84.2,41.66 84.47,41.79 C11.2 86.11,42.94 86.11,44.32 85.86,44.57 A139_HALL5.P$3_4
HALL5_OUTPUT  (via drill 0.33)
  Top 0.178: U$2.4 46.2,26.39 46.61,26.8 46.74,26.8 47.37,27.43 49.02,27.43 v49.78,26.67 | v58.8,29.97 63.04,29.97 HALL5.4 | v54.36,29.97 v56.64,29.97
  Bottom 0.178: v49.78,26.67 52.58,26.67 53.85,27.94 53.85,29.46 v54.36,29.97 | v56.64,29.97 v58.8,29.97
HALL5_VCC
  Top 0.178: C11.1 85.09,39.62 85.34,39.37 85.34,36.58 84.71,35.94 83.46,35.94 HALL5_HEADER.P$2 81.66,37.74 81.66,38.48 80.9,39.12 80.9,40.77 81.28,41.02 82.93,41.02 83.31,41.4 83.31,42.8 | A139_HALL5.P$1 84.34,43.57 83.69,42.93 83.44,42.93 83.31,42.8 | A139_HALL5.P$6 81.91,43.57 82.55,42.93 83.19,42.93 83.31,42.8
HALL5_VOUT
  Top 0.178: HALL5_HEADER.P$3 84.06,38.49 83.69,38.86 83.69,41.91 84.2,42.42 84.2,42.55 84.33,42.67 85.34,42.67 85.72,43.18 85.72,44.07 A139_HALL5.P$2
HALL6_!SLEEP  (via drill 0.33)
  Top 0.178: SHIFT_0.6 v46.23,29.72 | v49.66,27.81 51.32,27.81 HALL6.3
  Bottom 0.178: v46.23,29.72 47.24,29.72 v49.66,27.81
HALL6_!SLEEP_IN
  Top 0.178: R18.1 74.68,26.54 HALL6_HEADER.P$4
HALL6_GND
  Top 0.178: HALL6_HEADER.P$1 77.6,25.42 77.6,26.8 77.34,26.92 76.83,26.92 76.71,27.18 76.71,29.34 76.85,29.48 C12.2 78.74,30.75 78.74,32 78.37,32.25 A139_HALL6.P$3_4
HALL6_OUTPUT
  Top 0.178: U$2.3 46.85,24.14 47.62,23.37 48.13,23.37 50.16,25.53 HALL6.4
HALL6_VCC
  Top 0.178: A139_HALL6.P$6 74.41,31.25 74.93,30.73 75.82,30.73 | 75.82,30.73 76.78,30.73 A139_HALL6.P$1 | 75.82,30.73 75.82,28.96 75.56,28.7 74.04,28.7 73.66,28.19 73.66,27.18 74.3,26.54 74.3,24.77 74.54,24.52 HALL6_HEADER.P$2 76.1,23.62 77.34,23.62 77.98,24.26 77.98,27.3 77.6,27.69 C12.1
HALL6_VOUT
  Top 0.178: A139_HALL6.P$2 78.11,31.75 78.36,31.62 78.36,30.99 77.98,30.73 77.47,30.73 77.09,30.35 76.33,30.35 76.2,30.23 76.2,26.52 HALL6_HEADER.P$3
HALL7_!SLEEP  (via drill 0.33)
  Top 0.178: SHIFT_0.7 46.99,30.48 47.62,29.97 v48.51,29.97 | v52.07,27.94 v56.64,27.94 | v58.42,27.94 63.39,27.94 HALL7.3
  Bottom 0.178: v48.51,29.97 48.64,29.97 50.42,28.19 51.82,28.19 v52.07,27.94 | v56.64,27.94 v58.42,27.94
HALL7_!SLEEP_IN
  Top 0.178: R19.1 82.3,26.29 HALL7_HEADER.P$4
HALL7_GND
  Top 0.178: A139_HALL7.P$3_4 85.86,32.25 86.11,32 86.11,30.35 85.6,29.84 85.1,29.84 C13.2 84.34,29.48 84.2,29.34 84.2,27.18 84.33,26.92 84.96,26.8 84.96,25.42 HALL7_HEADER.P$1
HALL7_OUTPUT  (via drill 0.33)
  Top 0.178: U$2.2 47.5,24.76 v47.75,24.38 | v49.4,23.62 v56.64,23.62 | v58.42,23.62 61.9,23.62 HALL7.4
  Bottom 0.178: v47.75,24.38 48.51,24.38 v49.4,23.62 | v56.64,23.62 v58.42,23.62
HALL7_VCC
  Top 0.178: A139_HALL7.P$6 81.84,31.19 82.42,30.61 84.14,30.61 A139_HALL7.P$1 84.79,31.19 84.2,30.61 83.57,30.61 83.06,30.1 83.06,29.08 82.8,28.7 81.41,28.7 80.9,28.19 80.9,26.92 81.66,26.54 81.66,25.42 HALL7_HEADER.P$2 83.46,23.62 84.58,23.62 85.34,24.38 85.34,27.18 85.09,27.43 C13.1
HALL7_VOUT
  Top 0.178: A139_HALL7.P$2 85.47,31.75 85.72,31.5 85.72,30.99 85.47,30.73 84.96,30.73 84.45,30.23 83.95,30.23 83.69,29.97 83.69,26.65 HALL7_HEADER.P$3
HALL8_!SLEEP  (via drill 0.33)
  Top 0.178: SHIFT_1.15 40.39,11.56 v40.51,11.43
  Bottom 0.178: v40.51,11.43 40.51,12.7 43.81,16 52.2,16 52.58,16.38 52.58,18.91 HALL8.3
HALL8_!SLEEP_IN
  Top 0.178: R24.1 89.53,38.61 HALL8_HEADER.P$4
HALL8_GND
  Top 0.178: HALL8_HEADER.P$1 92.2,37.74 92.2,39.12 92.08,39.24 91.57,39.24 91.31,39.37 91.31,41.66 91.58,41.79 C20.2 93.34,42.81 93.34,44.2 92.97,44.57 A139_HALL8.P$3_4
HALL8_OUTPUT
  Top 0.178: U$2.23 47.5,17.52 47.75,17.27 48.94,17.27 HALL8.4
HALL8_VCC
  Top 0.178: C20.1 92.33,39.62 92.58,39.37 92.58,36.58 91.95,35.94 90.7,35.94 HALL8_HEADER.P$2 88.9,37.74 88.9,38.61 88.14,39.12 88.14,40.77 88.65,41.02 90.17,41.02 90.42,41.27 90.42,42.8 | A139_HALL8.P$1 91.7,43.57 90.81,42.93 90.42,42.8 | A139_HALL8.P$6 89.27,43.57 89.92,42.93 90.3,42.93 90.42,42.8
HALL8_VOUT
  Top 0.178: A139_HALL8.P$2 92.84,44.07 92.96,43.94 92.96,43.31 92.33,42.67 91.31,42.67 90.81,42.42 90.81,38.97 HALL8_HEADER.P$3
HALL9_!SLEEP  (via drill 0.33)
  Top 0.254: SHIFT_1.1 39.12,7.87 42.55,11.05 v46.48,11.05 | v54.48,12.45 v56.64,12.45 | v62.1,15.62 62.61,15.62 65.79,18.8 65.79,19.92 HALL9.3
  Bottom 0.254: v46.48,11.05 50.67,11.05 51.69,12.32 v54.48,12.45 | v56.64,12.45 60.33,12.45 v62.1,15.62
HALL9_!SLEEP_IN
  Top 0.178: R20.1 96.77,38.61 HALL9_HEADER.P$4
HALL9_GND
  Top 0.178: HALL9_HEADER.P$1 99.44,37.74 99.44,39.12 99.31,39.24 98.68,39.24 98.55,39.37 98.55,41.66 98.69,41.79 C15.2 100.58,42.94 100.58,44.32 100.34,44.57 A139_HALL9.P$3_4
HALL9_OUTPUT  (via drill 0.33)
  Top 0.178: U$2.22 46.85,17.54 47.5,16.89 49.91,16.89 51.69,18.67 v56.52,18.67 | v58.42,18.67 62.53,18.67 HALL9.4
  Bottom 0.178: v56.52,18.67 v58.42,18.67
HALL9_VCC
  Top 0.178: C15.1 99.44,39.62 99.82,39.24 99.82,36.45 99.31,35.94 97.94,35.94 HALL9_HEADER.P$2 96.14,37.74 96.14,38.61 95.38,39.12 95.38,40.51 95.76,41.02 97.28,41.02 97.54,41.27 97.54,42.67 | A139_HALL9.P$1 99.07,43.57 98.3,42.93 98.04,42.93 97.54,42.67 | A139_HALL9.P$6 96.31,43.38 96.77,42.93 97.28,42.93 97.54,42.67
HALL9_VOUT
  Top 0.178: A139_HALL9.P$2 100.08,44.07 100.2,43.94 100.2,43.05 99.82,42.67 98.68,42.67 98.17,42.16 98.17,38.71 HALL9_HEADER.P$3
HALL10_!SLEEP  (via drill 0.33)
  Top 0.254: SHIFT_1.2 40.39,8.13 42.93,10.41 v47.37,10.41 | v52.83,10.41 52.96,10.67 53.59,11.81 53.59,14.34 HALL10.3
  Bottom 0.254: v47.37,10.41 v52.83,10.41
HALL10_!SLEEP_IN
  Top 0.178: HALL10_HEADER.P$4 89.8,27.44 R21.1
HALL10_GND
  Top 0.178: A139_HALL10.P$3_4 93.1,32.25 93.34,32 93.34,30.35 92.71,29.72 92.21,29.72 C16.2 91.45,29.48 91.19,29.08 91.19,27.18 91.57,26.92 91.95,26.92 92.2,26.8 92.2,25.42 HALL10_HEADER.P$1
HALL10_OUTPUT
  Top 0.178: U$2.21 46.2,17.43 47.12,16.51 49.45,16.51 HALL10.4
HALL10_VCC
  Top 0.178: 90.3,30.48 90.3,28.7 88.65,28.7 88.14,28.19 88.14,26.92 88.9,26.29 88.9,25.02 89.4,24.52 HALL10_HEADER.P$2 90.7,23.62 91.95,23.62 92.58,24.26 92.58,27.18 92.2,27.56 C16.1 | 90.3,30.48 90.81,30.73 91.51,30.73 A139_HALL10.P$1 | A139_HALL10.P$6 89.15,31.25 89.66,30.73 90.3,30.73 90.3,30.48
HALL10_VOUT
  Top 0.178: A139_HALL10.P$2 92.71,31.75 92.96,31.5 92.96,30.86 92.84,30.73 92.2,30.73 91.82,30.35 91.19,30.35 90.68,30.1 90.68,26.77 HALL10_HEADER.P$3
HALL11_!SLEEP  (via drill 0.33)
  Top 0.254: SHIFT_1.3 41.66,8.38 43.05,9.78 v48.13,9.78 | v50.42,9.78 v56.64,9.78 | v65.79,10.03 65.79,14.34 HALL11.3
  Bottom 0.254: v48.13,9.78 v50.42,9.78 | v56.64,9.78 v65.79,10.03
HALL11_!SLEEP_IN
  Top 0.178: R22.1 96.77,26.29 HALL11_HEADER.P$4
HALL11_GND
  Top 0.178: HALL11_HEADER.P$1 99.44,25.42 99.44,26.42 98.68,27.18 98.68,29.21 98.94,29.48 C17.2 100.58,30.36 100.58,32 100.34,32.25 A139_HALL11.P$3_4
HALL11_OUTPUT  (via drill 0.33)
  Top 0.178: U$2.20 45.55,19.52 v45.72,19.68 | v51.94,17.27 53.21,17.27 53.34,17.4 v56.52,17.4 | v58.42,17.4 61.47,14.35 HALL11.4
  Bottom 0.178: v45.72,19.68 49.53,19.68 v51.94,17.27 | v56.52,17.4 v58.42,17.4
HALL11_VCC
  Top 0.178: 97.92,30.48 97.92,28.96 97.66,28.7 95.89,28.7 95.38,28.45 95.38,26.92 96.14,26.16 96.14,25.27 96.89,24.52 HALL11_HEADER.P$2 97.94,23.62 99.31,23.62 99.82,24.13 99.82,26.92 99.57,27.18 C17.1 | 97.92,30.48 98.04,30.61 98.5,30.61 A139_HALL11.P$1 | A139_HALL11.P$6 96.26,31.25 96.9,30.61 97.79,30.61 97.92,30.48
HALL11_VOUT
  Top 0.178: A139_HALL11.P$2 99.95,31.75 100.2,31.62 100.2,30.99 99.82,30.73 99.19,30.73 98.68,30.23 98.3,30.23 98.3,26.27 HALL11_HEADER.P$3
HALL12_!SLEEP  (via drill 0.33)
  Top 0.254: HALL12.3 53.61,6.87 v52.58,5.84 | v44.32,5.46 43.56,5.46 42.93,6.1 SHIFT_1.4
  Bottom 0.254: v52.58,5.84 44.7,5.84 v44.32,5.46
HALL12_!SLEEP_IN
  Top 0.178: R23.1 89.53,14.48 HALL12_HEADER.P$4
HALL12_GND
  Top 0.178: A139_HALL12.P$3_4 93.1,20.44 93.34,20.19 93.34,18.68 C18.2 91.58,17.66 91.31,17.53 91.31,15.24 92.2,14.86 92.2,13.61 HALL12_HEADER.P$1
HALL12_OUTPUT
  Top 0.178: U$2.19 44.9,17.33 45.09,17.14 45.85,17.14 46.86,16.13 48.77,16.13 50.55,14.35 50.67,13.84 50.93,13.34 50.93,13.08 50.67,12.7 49.53,12.7 49.4,12.57 49.4,9.4 50.04,8.76 HALL12.4
HALL12_VCC
  Top 0.178: C18.1 92.33,15.49 92.58,15.24 92.58,12.57 91.82,11.81 90.7,11.81 HALL12_HEADER.P$2 88.9,13.61 88.9,14.35 88.14,15.11 88.14,16.64 88.65,16.89 90.04,16.89 90.42,17.27 90.42,18.67 | A139_HALL12.P$1 91.96,19.44 91.31,18.8 90.81,18.8 90.42,18.67 | A139_HALL12.P$6 89.08,19.38 89.66,18.8 90.17,18.8 90.42,18.67
HALL12_VOUT
  Top 0.178: A139_HALL12.P$2 92.96,19.94 92.96,19.18 92.2,18.41 91.31,18.41 90.81,18.29 90.81,14.84 HALL12_HEADER.P$3
HALL13_!SLEEP  (via drill 0.33)
  Top 0.254: SHIFT_1.5 44.2,8.64 v44.58,9.02 | v54.48,6.6 v56.77,6.6 | v65.79,6.6 65.79,8.75 HALL13.3
  Bottom 0.254: v44.58,9.02 44.58,7.75 45.72,6.6 v54.48,6.6 | v56.77,6.6 v65.79,6.6
HALL13_!SLEEP_IN
  Top 0.178: R25.1 96.65,14.61 HALL13_HEADER.P$4
HALL13_GND
  Top 0.178: A139_HALL13.P$3_4 100.21,20.44 100.58,20.19 100.58,18.55 C21.2 98.94,17.54 98.68,17.27 98.68,15.37 99.44,14.61 99.44,13.61 HALL13_HEADER.P$1
HALL13_OUTPUT  (via drill 0.33)
  Top 0.178: U$2.18 44.25,16.84 44.32,16.76 45.59,16.76 46.61,15.75 48.64,15.75 50.16,14.1 v50.16,13.34 | v50.16,12.06 v51.94,11.43 | v54.48,11.43 v56.64,11.43 | v58.42,11.43 61.01,11.43 HALL13.4
  Bottom 0.178: v50.16,13.34 v50.16,12.06 | v51.94,11.43 v54.48,11.43 | v56.64,11.43 v58.42,11.43
HALL13_VCC
  Top 0.178: 97.54,18.67 97.54,17.27 97.28,16.89 95.89,16.89 95.38,16.64 95.38,15.11 96.14,14.48 96.14,13.21 96.64,12.71 HALL13_HEADER.P$2 97.94,11.81 99.19,11.81 99.82,12.45 99.82,14.86 99.69,14.99 C21.1 | 97.54,18.67 97.92,18.8 98.75,18.8 A139_HALL13.P$1 | A139_HALL13.P$6 96.44,19.38 96.9,18.92 97.54,18.92 97.54,18.67
HALL13_VOUT
  Top 0.178: A139_HALL13.P$2 100.2,19.94 100.2,19.05 99.69,18.41 98.42,18.41 98.04,18.16 98.04,14.84 HALL13_HEADER.P$3
HALL14_!SLEEP  (via drill 0.33)
  Top 0.254: SHIFT_1.6 v45.47,5.21 | v50.67,5.21 51.58,5.21 HALL14.3
  Bottom 0.254: v45.47,5.21 v50.67,5.21
HALL14_!SLEEP_IN
  Top 0.178: HALL14_HEADER.P$4 89.8,4.32 R26.1
HALL14_GND
  Top 0.178: HALL14_HEADER.P$1 91.45,1.41 92.2,2.16 92.2,3.56 91.95,3.81 91.57,3.81 91.44,3.94 91.44,6.22 91.57,6.35 92.19,6.35 C22.2 92.44,6.6 92.96,6.6 93.34,6.99 93.34,8.76 92.97,9.14 A139_HALL14.P$3_4
HALL14_OUTPUT
  Top 0.178: U$2.17 43.6,16.6 43.81,16.38 45.47,16.38 46.48,15.37 48.51,15.37 49.53,14.1 49.53,13.21 49.02,12.95 49.02,4.58 49.14,4.47 | 49.02,4.57 49.14,4.47 | 49.14,4.47 50.42,3.3 51.48,3.3 HALL14.4
HALL14_VCC
  Top 0.178: A139_HALL14.P$6 89.27,8.14 89.92,7.49 90.3,7.49 | 90.3,7.49 91.51,7.49 A139_HALL14.P$1 | 90.3,7.49 90.3,5.84 90.04,5.59 88.77,5.59 88.14,5.33 88.14,3.81 88.9,3.05 88.9,2.03 89.52,1.41 HALL14_HEADER.P$2 90.7,0.51 92.08,0.51 92.58,1.02 92.58,3.94 92.33,4.19 C22.1
HALL14_VOUT
  Top 0.178: A139_HALL14.P$2 92.96,8.64 92.96,7.75 92.84,7.49 92.08,7.49 91.69,7.11 91.19,7.11 90.81,6.6 90.81,3.66 HALL14_HEADER.P$3
HALL15_!SLEEP
  Top 0.254: SHIFT_1.7 46.74,3.05 48.01,1.78 64.41,1.78 HALL15.3
HALL15_!SLEEP_IN
  Top 0.178: R27.1 96.52,3.43 HALL15_HEADER.P$4
HALL15_GND
  Top 0.178: A139_HALL15.P$3_4 100.47,9.14 100.58,9.02 100.58,7.38 C24.2 98.69,6.36 98.42,6.1 98.42,4.19 98.81,3.81 99.31,3.81 99.44,3.68 99.44,2.31 HALL15_HEADER.P$1
HALL15_OUTPUT  (via drill 0.33)
  Top 0.178: U$2.16 42.95,16.74 43.69,16 45.21,16 46.23,14.99 48.39,14.99 48.9,14.22 v48.9,13.72 | v54.61,7.62 v56.52,7.62 | v58.42,7.62 58.42,6.91 HALL15.4
  Bottom 0.178: v48.9,13.72 48.9,13.59 47.62,12.32 46.23,12.32 45.59,11.68 45.59,10.16 48.39,7.37 54.36,7.37 v54.61,7.62 | v56.52,7.62 v58.42,7.62
HALL15_VCC
  Top 0.178: A139_HALL15.P$6 96.31,8.08 96.9,7.49 97.54,7.49 | 97.54,7.49 98.62,7.49 A139_HALL15.P$1 | 97.54,7.49 97.54,5.97 97.16,5.59 95.76,5.59 95.5,5.33 95.5,3.81 96.14,3.17 96.14,2.03 96.76,1.41 HALL15_HEADER.P$2 97.94,0.51 99.31,0.51 99.82,1.02 99.82,3.94 99.57,4.19 C24.1
HALL15_VOUT
  Top 0.178: A139_HALL15.P$2 100.2,8.64 100.2,7.87 100.08,7.62 99.31,7.62 98.81,7.11 98.04,7.11 97.92,6.99 97.92,3.53 HALL15_HEADER.P$3
LED_GRN  (via drill 0.33)
  Top 0.178: v25.53,24.13 29.46,28.07 29.46,30.3 U1.26 | v21.72,22.99 20.95,23.75 19.98,23.75 R2.2
  Bottom 0.178: v21.72,22.99 24.38,22.99 v25.53,24.13
LED_RED
  Top 0.178: R1.2 17.65,24.51 16.64,25.4 16.64,27.18 17.65,28.19 22.98,28.19 U1.2
MISO  (via drill 0.33)
  Top 0.178: v32.77,12.32 32.77,5.71 30.48,3.81 28.96,3.81 27.81,2.67 25.53,2.67 25.27,2.92 25.27,3.94 25.02,4.19 19.9,4.19 U$1.MISO7 | U1.16 30.23,20.82 v30.35,20.57 | v29.84,18.03 31.45,18.03 J1.1
  Bottom 0.178: J1.1 33.83,15.16 33.78,15.24 33.78,13.21 v32.77,12.32 | v30.35,20.57 30.35,19.68 v29.84,18.03
MOSI  (via drill 0.33)
  Top 0.178: v28.19,12.06 28.19,9.14 27.69,8.64 23.73,8.64 U$1.MOSI3 | v29.46,20.57 29.46,21.71 U1.15 29.46,21.77 29.46,23.62 29.59,23.75 v29.59,27.3 | SHIFT_0.14 41.91,36.2 38.61,32.77 38.61,30.35 38.23,29.97 v34.42,29.97
  Bottom 0.178: v28.19,12.06 30,13.87 J1.4 29.41,14.66 28.7,15.49 28.7,17.91 29.08,18.54 29.08,20.19 v29.46,20.57 | v29.59,27.3 31.75,29.97 v34.42,29.97
MUX_!EN
  Top 0.178: U1.12 27.03,20.72 27.69,19.94 37.1,19.94 R28.1 37.62,19.7 41.64,19.7 42.29,19.05 U$2.15
MUX_S0  (via drill 0.33)
  Top 0.178: U1.13 27.83,22.62 v28.32,23.24 | v38.35,23.5 40.26,25.53 40.26,26.54 40.51,26.8 42.04,26.8 42.29,26.54 U$2.10 | v30.23,23.24 30.86,22.61 30.86,21.97 31.37,21.46 35.31,21.46 v35.56,21.72
  Bottom 0.178: v35.56,21.72 36.7,21.72 v38.35,23.5 | v28.32,23.24 v30.23,23.24
MUX_S1  (via drill 0.33)
  Top 0.178: 24.63,22.35 U1.9 24.63,20.2 26.04,18.67 35.18,18.67 36.2,17.78 39.5,17.78 v40.01,17.14 | v41.78,21.08 41.78,24.51 41.66,24.64 U$2.11
  Bottom 0.178: v40.01,17.14 40.01,19.43 v41.78,21.08
MUX_S2
  Top 0.178: U1.10 25.43,20.16 26.29,19.18 35.31,19.18 36.45,18.16 39.88,18.16 40.77,17.27 41.53,17.27 41.66,17.4 U$2.14
MUX_S3
  Top 0.178: U1.11 26.23,20.38 26.92,19.56 35.43,19.56 36.58,18.54 40.77,18.54 U$2.13
N$2
  Top 0.178: LED1.A R1.1
N$3
  Top 0.178: R31.2 3.21,32.35 4.06,31.5 6.84,31.5 BJT.1
N$4
  Top 0.178: P-FET.3 12.4,34.88 11.68,34.16 11.68,32.51 14.35,29.84 15.2,29.84 R30.2
N$7  (via drill 0.33)
  Top 0.178: U1.20 34.14,25.64 v34.29,25.65
  Bottom 0.178: v34.29,25.65 36.7,25.65 37.08,26.04 38.66,26.04 U$17.1
N$10
  Top 0.178: LED2.A R2.1
NC1
  Top 0.178: U$1.NC1 25.33,10.8 R5.1
QH*  (via drill 0.33)
  Top 0.178: SHIFT_1.14 41.66,14.73 v41.91,14.99 | v42.67,27.3 42.67,28.19 v41.53,29.34 | SHIFT_0.9 48.26,35.81 47.88,35.31 v43.31,35.31 | v42.67,21.08 v42.67,23.88
  Bottom 0.178: v41.91,14.99 41.91,15.24 43.31,16.64 43.31,18.29 42.42,19.18 42.42,20.83 v42.67,21.08 | v41.53,29.34 41.53,33.78 v43.31,35.31 | v42.67,23.88 v42.67,27.3
RES8
  Top 0.178: U$1.RES8 24.07,3.1 25.4,1.78 26.53,1.78 R4.1
RESET  (via drill 0.33)
  Top 0.178: J1.5 27.89,16.43 28.7,15.75 28.7,13.34 v30.48,11.56 | v34.16,11.56 34.16,10.23 RESET.S$1 | 27.05,30.35 v27.05,26.67 | C5.2 16.08,40.56 17.65,38.99 18.16,38.99
  Top 0.254: 18.16,38.99 19.22,38.99 R6.1 20.47,37.19 21.34,36.32 23.11,36.32 27.05,32.38 27.05,30.35 U1.29
  Bottom 0.178: v30.48,11.56 v34.16,11.56 | v27.05,26.67 27.05,19.05 27.08,17.25 J1.5
SCK  (via drill 0.33)
  Top 0.178: J1.3 30.5,15.72 31.24,15.11 | 31.24,15.11 38.99,15.11 40.39,16.26 41.02,16.26 41.27,16 42.67,16 43.43,15.24 44.83,15.24 45.47,14.61 SHIFT_1.11 | 31.24,15.11 31.24,9.02 28.57,6.35 | 31.75,23.21 U1.17 | v31.62,22.35 31.62,23.13 U1.17 | U1.17 33.4,23.23 v33.53,23.37 | v40.26,29.34 40.26,27.43 40.13,27.3 38.99,27.3 38.35,27.94 36.45,27.94 36.07,28.32 v34.8,28.32 | SHIFT_0.11 45.72,36.07 45.59,36.07 42.8,36.07 v42.04,35.31 | 25.53,6.35 19.95,6.35 U$1.SCK5
  Top 0.203: 25.53,6.35 26.04,5.84 28.07,5.84 28.57,6.35
  Bottom 0.178: J1.3 29.87,16.66 30,16.66 31.62,19.94 v31.62,22.35 | v40.26,29.34 40.26,33.53 v42.04,35.31 | v33.53,23.37 33.53,25.91 34.8,27.18 v34.8,28.32
SCL
  Top 0.178: DS3231M.8 32.11,39.85 31.37,40.59 28.19,40.59 27.69,40.08 27.69,38.61 27.46,38.38 23.53,38.38 | 22.5,36.78 R7.1 | 34.92,39.88 34.92,43.05 I2C_HEADER.3
  Top 0.203: 25.78,34.29 24.31,35.76 | 34.92,39.88 DS3231M.8 | 23.53,38.38 R7.1
  Top 0.254: 22.5,36.78 23.29,36.78 24.31,35.76 | 25.78,34.29 27.81,32.26 27.81,30.35 U1.28
SDA
  Top 0.178: 26.09,34.75 28.7,32.13 | 28.7,32.13 28.7,30.4 U1.27 | 28.7,32.13 32.64,36.07 32.64,38.23 33.02,38.61 33.91,38.61 33.93,38.58 | DS3231M.7 36.17,38.58 36.45,38.86 36.45,41.78 I2C_HEADER.4
  Top 0.203: DS3231M.7 33.93,38.58
  Top 0.254: 26.09,34.75 24.56,36.27 R8.1
SHIFT_CLEAR  (via drill 0.33)
  Top 0.178: v36.07,31.88 35.67,33.29 R14.1 35.69,33.64 35.56,33.02 31.73,29.18 U1.24 31.73,28.83 v33.15,28.83 | v46.99,35.94 SHIFT_0.10 | SHIFT_1.10 46.74,14.22 46.35,14.61 45.97,14.61 44.96,15.62 43.56,15.62 42.8,16.38 42.42,16.38 42.16,16.64 v41.91,16.64
  Bottom 0.178: v41.91,16.64 41.78,16.38 39.75,16.38 39.37,17.02 39.37,18.03 38.99,18.54 36.7,18.54 35.56,19.68 35.31,20.7 32.89,23.11 32.89,26.16 33.15,26.42 33.4,26.42 33.78,26.8 33.78,28.19 v33.15,28.83 | v36.07,31.88 37.21,32.38 40.77,35.94 v46.99,35.94
TO_FTDI_RX  (via drill 0.33)
  Top 0.254: JP1.5 15.24,41.91 15.75,41.4 v16.76,41.4 | v21.72,35.56 25.4,31.88 25.4,30.36 U1.31
  Bottom 0.254: v21.72,35.56 19.68,37.59 19.68,40.13 19.18,40.64 18.03,40.64 17.4,41.4 v16.76,41.4
TO_FTDI_TX  (via drill 0.33)
  Top 0.254: JP1.4 18.77,42.32 18.77,41.81 v19.05,41.53 | v23.5,34.92 26.16,32.26 26.16,30.4 U1.30
  Bottom 0.254: v19.05,41.53 19.18,41.53 20.45,40.26 20.45,37.97 v23.5,34.92
VBAT  (via drill 0.33)
  Top 0.254: v33.27,37.34 34.87,37.34 DS3231M.6
  Bottom 0.254: CR1220_BATTERY.P$2 9.53,22.1 9.53,30.23 12.83,33.53 CR1220_BATTERY.P$1 24.26,34.04 27.56,37.34 v33.27,37.34
VCC  (via drill 0.33, 0.38 pad 0.61)
  Top 0.178: 30.96,38.58 31.14,38.58 31.5,38.23 31.5,36.58 v31.75,36.32 | v32.26,33.02 R14.2 33.67,33.8 34.67,34.8 36.2,34.8 37.08,35.69 38.76,37.74 SHIFT_0.16 | SHIFT_1.16 38.45,12.69 C8.1 36.82,12.7 36.07,12.7 34.37,13.89 J1.2 31.75,13.11 v31.75,8 | v32.64,20.7 35.56,20.7 36.32,21.59 | 36.32,21.59 36.32,22.7 INDUCTOR.P$2 36.42,23.85 36.83,24.26 37.72,24.26 37.85,24.38 v37.85,27.3 | 36.32,21.59 37.35,21.59 R28.2 38.56,21.55 C6.1 39.66,20.45 47.5,20.45 48.13,19.81 | 48.13,19.81 48.13,18.33 U$2.24 | v36.07,30.86 36.72,30.86 R15.2 37.47,32.93 C9.1 | 48.13,19.81 49.66,21.34 57.23,21.34 57.61,21.72 | 20.07,26.43 C3.1 | v28.45,7.49 28.16,7.79 R5.2 26.61,7.75 25.27,7.75 24.78,7.25 C4.1 23.49,7.5 U$1.VDD4 19.88,7.49 18.41,7.49 18.03,7.87 18.03,14.61 19.05,15.62 20.7,15.62 21.59,16.51 21.59,20.19 24.38,22.99 24.38,24.51 24.07,24.82 24.07,24.84 24.96,24.84 25.27,25.15 25.27,26.16 25.02,26.42 23.16,26.42 | 20.33,39.5 19.05,39.5 v18.8,39.75 | 17.37,35.66 17.37,33.66 C2.+ 17.37,33.15 17.37,32.03 | C7.1 27.47,41.82 29.34,43.69 I2C_HEADER.1
  Top 0.203: R9.2 R8.2 | R6.2 20.47,42.9 JP1.3
  Top 0.254: R4.2 26.56,4.95 v26.67,5.08 | v26.67,6.48 R5.2 | R8.2 R7.2 R6.2 20.33,39.5 | HALL14.1 HALL12.1 HALL10.1 HALL8.1 57.61,21.72 HALL6.1 HALL4.1 HALL2.1 HALL0.1 57.61,43.64 58.42,44.45 67.64,44.45 HALL1.1 HALL3.1 HALL5.1 HALL7.1 HALL9.1 HALL11.1 HALL13.1 HALL15.1 | MCP1700T-3302.2 17.91,33.93 C2.+ | 17.37,35.66 v17.4,35.69 | 17.37,32.03 v19.43,29.97 | C3.1 23.12,26.42 U1.4 23.16,26.42 | U1.6 24.07,24.84 | DS3231M.2 30.96,38.58 v31.37,38.99 | v26.92,40.39 R9.2 | 20.07,26.43 20.07,25.4 v19.94,25.27
  Bottom 0.178: v31.75,36.32 31.75,34.42 v32.26,33.02 | v32.64,20.7 32.64,18.54 31.24,17.14 31.24,15.11 32.46,13.89 J1.2 | v28.45,7.49 31.24,7.49 v31.75,8 | v37.85,27.3 36.45,27.3 36.07,27.69 v36.07,30.86 | I2C_HEADER.1 30.48,39.88 v31.37,38.99
  Bottom 0.254: v26.67,5.08 v26.67,6.48 | v17.4,35.69 17.4,39.12 v18.8,39.75 | v19.43,29.97 19.43,27.56 19.94,27.05 v19.94,25.27 | v31.37,38.99 28.32,38.99 v26.92,40.39
VRAW  (via drill 0.33)
  Top 0.178: P-FET.2 10.08,34.71 R33.2 8.68,34.71 v9.65,35.56 | 20.83,34.42 MCP1700T-3302.3
  Top 0.254: 20.83,34.42 17.37,37.74 C1.+ 16.1,39.12 10.92,39.12 v9.53,37.72 9.14,37.34 X1.2
  Bottom 0.178: v9.65,35.56 9.65,37.59 v9.53,37.72